# Altium schematic sheet Latching 2.SchDoc
size Letter
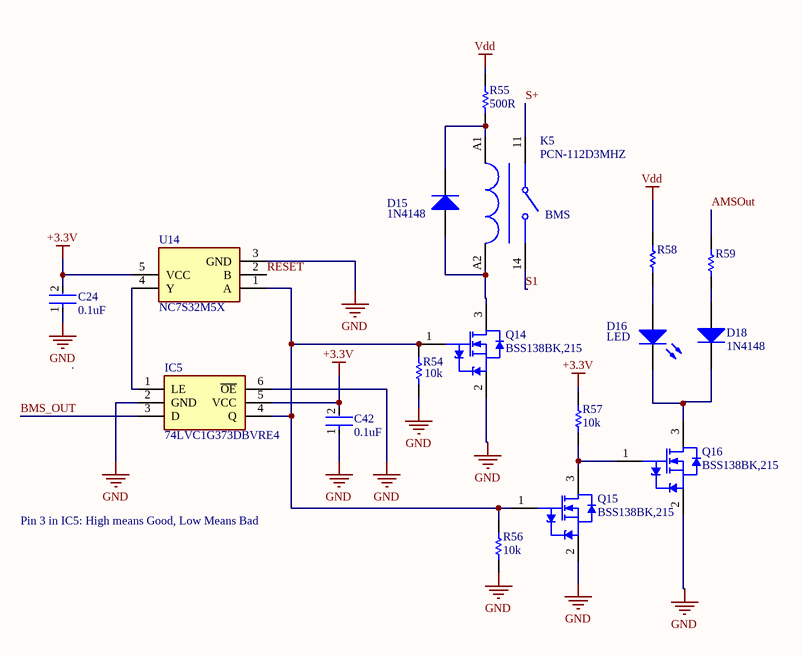
[diagram p0: Latching 2.SchDoc]

## Parts
C24  0.1uF  [FP-C0603-CJ-MFG]
C42  0.1uF  [FP-C0603-CJ-MFG]
D15  1N4148  [DIOD-SOD123-2_V]
D16  LED  [1206_A]
D18  1N4148  [DIOD-SOD123-2_V]
IC5  74LVC1G373DBVRE4  [SOT95P280X145-6N]
K5  PCN-112D3MHZ  [PCN-112D3MHZ]
Q14  BSS138BK,215  [NXP-SOT23_N]
Q15  BSS138BK,215  [NXP-SOT23_N]
Q16  BSS138BK,215  [NXP-SOT23_N]
R54  10k  [RESC1608X55N]
R55  500R  [RESC1608X55N]
R56  10k  [RESC1608X55N]
R57  10k  [RESC1608X55N]
R58  CRCW2512649RFKEG  [Resistor__E2512]  (value not drawn)
R59  CRCW2512649RFKEG  [Resistor__E2512]  (value not drawn)
U14  NC7S32M5X  [SOT95P275X110-5N]

## Nets
+3.3V: C24.2 C42.2 IC5.5(VCC) R57.2 U14.5(VCC)
GND: C24.1 C42.1 IC5.2(GND) IC5.6(~{OE}) Q14.2(S) Q15.2(S) Q16.2(S) R54.1 R56.1 U14.3(GND)
Vdd: R55.2 R58.2
AMSOut: R59.2
BMS_OUT: IC5.3(D)
RESET: U14.2(B)
S1: K5.14
S+: K5.11
NetD15_1: D15.1(A) K5.A2 Q14.3(D)
NetD15_2: D15.2(K) K5.A1 R55.1
NetD16_1: D16.1(K) D18.2(K) Q16.3(D)
NetD16_2: D16.2(A) R58.1
NetD18_1: D18.1(A) R59.1
NetIC5_1: IC5.1(LE) U14.4(Y)
NetIC5_4: IC5.4(Q) Q14.1(G) Q15.1(G) R54.2 R56.2 U14.1(A)
NetQ15_3: Q15.3(D) Q16.1(G) R57.1

## Notes on the sheet
- (near K5) BMS
- Pin 3 in IC5: High means Good, Low Means Bad

## Library data of the parts
C24 C42 = CMP-2006-03300-2: CAP CER 0.1UF 50V X7R 0603; Manufacturer Part Number: C0603X104K5RACTU; Manufacturer: Kemet; Capacitance: 100nF; Material: Ceramic; Tolerance: 10%; Value: 100nF; Temperature Coefficient: 15%; Temperature Range High: +125°C; Temperature Range Low: -55°C; Voltage: 50V; ComponentLink2Description: Datasheet; RoHS: TRUE; ComponentLink2URL: https://content.kemet.com/datasheets/KEM_C1013_X7R_FT-CAP_SMD.pdf; Device Class L3: Ceramic Capacitors; Device Class L2: Capacitors; Package: C0603-CJ; Height: 0.95mm; Device Class L1: Passive Components; Temperature Characteristic: X7R; Lead Free: Yes; Digikey Description: CAP CER 0.1UF 50V X7R 0603; Automotive: No; Mouser Description: Capacitor; Ceramic; Cap 0.1uF; Tol+10%; SMT; Flexible Termination; Vol-Rtg 50V; TR; Temperature: -55°C to +125°C; Octopart: https://octopart.com/c0603x104k5ractu-kemet-9145062; Category: Cap; Voltage Rating: 50V; Ipc Land Pattern Name: CAPC16080X80
D15 D18 = 1N4148W-7-F: DIODE GEN PURP 100V 300MA SOD123; Manufacturer 1: Diodes; Forward Current: 150mA; Element Configuration: Single; Reverse Recovery Time: 4ns; Max Forward Surge Current (Ifsm): 2A; Polarity: Standard; Voltage Rating (DC): 75V; Power Rating: 400mW; Capacitance: 2pF; Peak Reverse Current: 1uA; Forward Voltage: 1.25V; Supplier 1: Digi-Key; Supplier Part Number 1: 1N4148W-FDIDKR-ND; Manufacturer Part Number 1: 1N4148W-7-F; Stock 1: 3523690; Pricing 1: 1=0.16000, 10=0.14600, 25=0.13880, 100=0.06110, 250=0.05868, 500=0.04800, 1000=0.03333 (USD); RoHS: Yes; Mount: Surface Mount; Number of Pins: 2; Weight: 0.000353oz; Contact Plating: Tin,Matte; Min Operating Temperature: -65°C; Max Operating Temperature: 150°C; Voltage: 100V; Packaging: Tape and Reel; Max Repetitive Reverse Voltage (Vrrm): 100V; Peak Non-Repetitive Surge Current: 2A; Current Rating: 150mA; Output Current: 150mA; Max Surge Current: 2A; Package Quantity: 3000; Recovery Time: 4ns; Max Reverse Voltage (DC): 100V; Average Rectified Current: 300mA; Power Dissipation: 400mW; Length: 2.85mm; Height: 1.25mm; Width: 1.7mm; Radiation Hardening: No; REACH SVHC: No SVHC; Lead Free: Lead Free; ComponentLink1URL: https://datasheet.ciiva.com/911/ds30086-911734.pdf?src-supplier=Digi-Key; ComponentLink1Description: https://datasheet.ciiva.com/911/ds30086-911734.pdf?src-supplier=Digi-Key; ComponentLink2URL: https://datasheet.ciiva.com/911/ds30086-911735.pdf?src-supplier=Digi-Key; ComponentLink2Description: https://datasheet.ciiva.com/911/ds30086-911735.pdf?src-supplier=Digi-Key; ComponentLink3URL: https://datasheet.ciiva.com/911/ds30086-911736.pdf?src-supplier=Digi-Key; ComponentLink3Description: https://datasheet.ciiva.com/911/ds30086-911736.pdf?src-supplier=Digi-Key; ComponentLink4URL: https://datasheet.ciiva.com/8300/ds30086-8300392.pdf?src-supplier=Avnet; ComponentLink4Description: https://datasheet.ciiva.com/8300/ds30086-8300392.pdf?src-supplier=Avnet; ComponentLink5URL: https://datasheet.ciiva.com/25919/ds30086-25919609.pdf?src-supplier=Avnet+Europe; ComponentLink5Description: https://datasheet.ciiva.com/25919/ds30086-25919609.pdf?src-supplier=Avnet+Europe; ComponentLink6URL: https://datasheet.ciiva.com/22695/1915529-22695239.pdf?src-supplier=Element14; ComponentLink6Description: https://datasheet.ciiva.com/22695/1915529-22695239.pdf?src-supplier=Element14; ComponentLink7URL: https://datasheet.ciiva.com/1179/1915529-1179304.pdf?src-supplier=Element14; ComponentLink7Description: https://datasheet.ciiva.com/1179/1915529-1179304.pdf?src-supplier=Element14; ComponentLink8URL: https://datasheet.ciiva.com/4435/ds30086-4435128.pdf?src-supplier=Mouser; ComponentLink8Description: https://datasheet.ciiva.com/4435/ds30086-4435128.pdf?src-supplier=Mouser; ComponentLink9URL: https://datasheet.ciiva.com/15219/getdatasheetpartid-110030-15219548.pdf?src-supplier=Verical; ComponentLink9Description: https://datasheet.ciiva.com/15219/getdatasheetpartid-110030-15219548.pdf?src-supplier=Verical; ComponentLink10URL: https://datasheet.ciiva.com/8303/ds30086-8303197.pdf?src-supplier=Avnet; ComponentLink10Description: https://datasheet.ciiva.com/8303/ds30086-8303197.pdf?src-supplier=Avnet
D16 = 150120SS75000: WURTH ELEKTRONIK   150120SS75000   LED, 1206, SUP. RED, 60MCD, 630NM; Manufacturer 1: Wurth Electronics; Test Current: 20mA; Viewing Angle: 140°; Lens Style: Clear,Rectangular; Forward Current: 30mA; Forward Voltage: 1.9V; Supplier 1: Digi-Key; Supplier Part Number 1: 732-4992-1-ND; Manufacturer Part Number 1: 150120SS75000; Stock 1: 2344; Pricing 1: 1=0.21000, 50=0.19800, 100=0.17100, 500=0.14800 (USD); RoHS: Yes; Mount: Surface Mount; Case/Package: 1206; Color: Red; Case Code (Metric): 3216; Case Code (Imperial): 1206; Min Operating Temperature: -40°C; Max Operating Temperature: 85°C; Dominant Wavelength: 630nm; Package Quantity: 3000; Packaging: Tape and Reel; Luminous Intensity: 60mcd; Wavelength: 630nm; Length: 3.2mm; Height: 0.68mm; Width: 1.6mm; REACH SVHC: Unknown; ComponentLink1URL: https://datasheet.ciiva.com/29561/150120ss75000-29561862.pdf?src-supplier=Digi-Key; ComponentLink1Description: https://datasheet.ciiva.com/29561/150120ss75000-29561862.pdf?src-supplier=Digi-Key; ComponentLink2URL: https://datasheet.ciiva.com/29279/759443-da-01-en-chipled-1206-w-kl-s-rot-150120ss75000-29279053.pdf?src-supplier=Conrad; ComponentLink2Description: https://datasheet.ciiva.com/29279/759443-da-01-en-chipled-1206-w-kl-s-rot-150120ss75000-29279053.pdf?src-supplier=Conrad; ComponentLink3URL: https://datasheet.ciiva.com/29561/150120ss75000-29561863.pdf?src-supplier=Digi-Key; ComponentLink3Description: https://datasheet.ciiva.com/29561/150120ss75000-29561863.pdf?src-supplier=Digi-Key; ComponentLink4URL: https://datasheet.ciiva.com/48430/150120ss75000-eng-tds-48430055.pdf?src-supplier=Distrelec; ComponentLink4Description: https://datasheet.ciiva.com/48430/150120ss75000-eng-tds-48430055.pdf?src-supplier=Distrelec; ComponentLink5URL: https://datasheet.ciiva.com/29561/150120ss75000-29561864.pdf?src-supplier=Digi-Key; ComponentLink5Description: https://datasheet.ciiva.com/29561/150120ss75000-29561864.pdf?src-supplier=Digi-Key
IC5 = 74LVC1G373DBVRE4: Integrated Circuit; Manufacturer_Name: Texas Instruments; Datasheet Link: http://www.ti.com/general/docs/suppproductinfo.tsp?distId=10&gotoUrl=http%3A%2F%2Fwww.ti.com%2Flit%2Fgpn%2Fsn74lvc1g373; Height: 1.45mm; Manufacturer_Part_Number: 74LVC1G373DBVRE4
K5 = PCN-112D3MHZ: Relay
Q14-Q16 = CMP-1259-00087-1: N-Channel Trench MOSFET, 60 V, 0.36 A, -55 to 150 degC, 3-Pin SOT23, Tape and Reel; Manufacturer: NXP Semiconductors; Channel Type: N; IDM [max] (A): 1.2; VDS [max] (V): 60; Packing: Tape & Reel; ID [max] (A): 0.36; Automotive Qualified: Y; VGSth [typ] (V): 1.1; PackageReference: SOT23; Code_JEDEC: TO-236AB; PackageDescription: 3-Pin Small Outline Transistor Package, Body 2.9 x 1.3 mm, Pitch 0.95 mm; ComponentLink2URL: http://www.nxp.com/documents/data_sheet/BSS138BK.pdf; PartNumber: BSS138BK,215; DatasheetVersion: Rev. 1; ComponentLink3Description: Package Specification; ComponentLink3URL: http://www.nxp.com/documents/outline_drawing/sot023_po.pdf; Mounting Technology: Surface Mount; ComponentLink1URL: http://www.nxp.com/; ComponentLink1Description: Manufacturer URL; ComponentLink2Description: Datasheet; PackageVersion: 06-03-16, 03/2006
R54-R57 = RC0805JR-0710KL: 10k E0805 1% 1/8W; Tolerance: 5%; Resistance: 10kR; Power Rating: 125mW; Temperature Coefficient: 100ppm/°C; Voltage Rating: 150V; MPN: *; Category: *; RoHS: Yes; Case/Package: 0805; Contact Plating: Tin; Case Code (Imperial): 0805; Case Code (Metric): 2012; Min Operating Temperature: -55°C; Max Operating Temperature: 155°C; Composition: Thick Film; Packaging: Tape and Reel; Termination: SMD/SMT; Military Standard: Not; Length: 2mm; Height: 0.5mm; Width: 1.25mm; Depth: 1.25mm; Radiation Hardening: No; REACH SVHC: Unknown; Lead Free: Lead Free; ComponentLink1URL: https://datasheet.ciiva.com/7941/444164-7941870.pdf?src-supplier=Element14; ComponentLink1Description: https://datasheet.ciiva.com/7941/444164-7941870.pdf?src-supplier=Element14; ComponentLink2URL: https://datasheet.ciiva.com/7941/444164-7941871.pdf?src-supplier=Element14; ComponentLink2Description: https://datasheet.ciiva.com/7941/444164-7941871.pdf?src-supplier=Element14; ComponentLink3URL: https://datasheet.ciiva.com/7983/444164-7983765.pdf?src-supplier=Element14; ComponentLink3Description: https://datasheet.ciiva.com/7983/444164-7983765.pdf?src-supplier=Element14; Supplier 1: Digi-Key; Supplier Part Number 1: 311-10KARCT-ND
R58 R59 = CRCW2512649RFKEG: RES SMD 649 OHM 1% 1W 2512; Manufacturer 1: Vishay Dale; Resistance: 649R; Temperature Coefficient: 100ppm/°C; Voltage Rating (DC): 500V; Supplier 1: Digi-Key; Supplier Part Number 1: 541-649AFCT-ND; Manufacturer Part Number 1: CRCW2512649RFKEG; Stock 1: 2166; Pricing 1: 1=0.38000, 10=0.31800, 100=0.12420, 1000=0.05198 (USD); RoHS: Yes; Case/Package: 2512; Case Code (Metric): 6432; Case Code (Imperial): 2512; Min Operating Temperature: -55°C; Max Operating Temperature: 155°C; Package Quantity: 10; Tolerance: 1%; Packaging: Tape and Reel; Composition: Thick Film; Number of Terminations: 2; Features: Automotive AEC-Q200; Max Power Dissipation: 1W; Length: 0.248inch; Height: 0.028inch; Width: 0.124inch; Lead Free: Lead Free; ComponentLink1URL: https://datasheet.ciiva.com/2479/dcrcwe3-2479296.pdf?src-supplier=Digi-Key; ComponentLink1Description: https://datasheet.ciiva.com/2479/dcrcwe3-2479296.pdf?src-supplier=Digi-Key; ComponentLink2URL: https://datasheet.ciiva.com/2479/dcrcwe3-2479297.pdf?src-supplier=Digi-Key; ComponentLink2Description: https://datasheet.ciiva.com/2479/dcrcwe3-2479297.pdf?src-supplier=Digi-Key; ComponentLink3URL: https://datasheet.ciiva.com/2479/dcrcwe3-2479298.pdf?src-supplier=Digi-Key; ComponentLink3Description: https://datasheet.ciiva.com/2479/dcrcwe3-2479298.pdf?src-supplier=Digi-Key
U14 = NC7S32M5X: OR GATEEEE; Manufacturer_Name: ON Semiconductor; Datasheet Link: https://componentsearchengine.com/Datasheets/2/NC7S32M5X.pdf; Height: 1.1mm; Manufacturer_Part_Number: NC7S32M5X